# EAGLE schematic RFID_H2 (EAGLE 9.6.1)
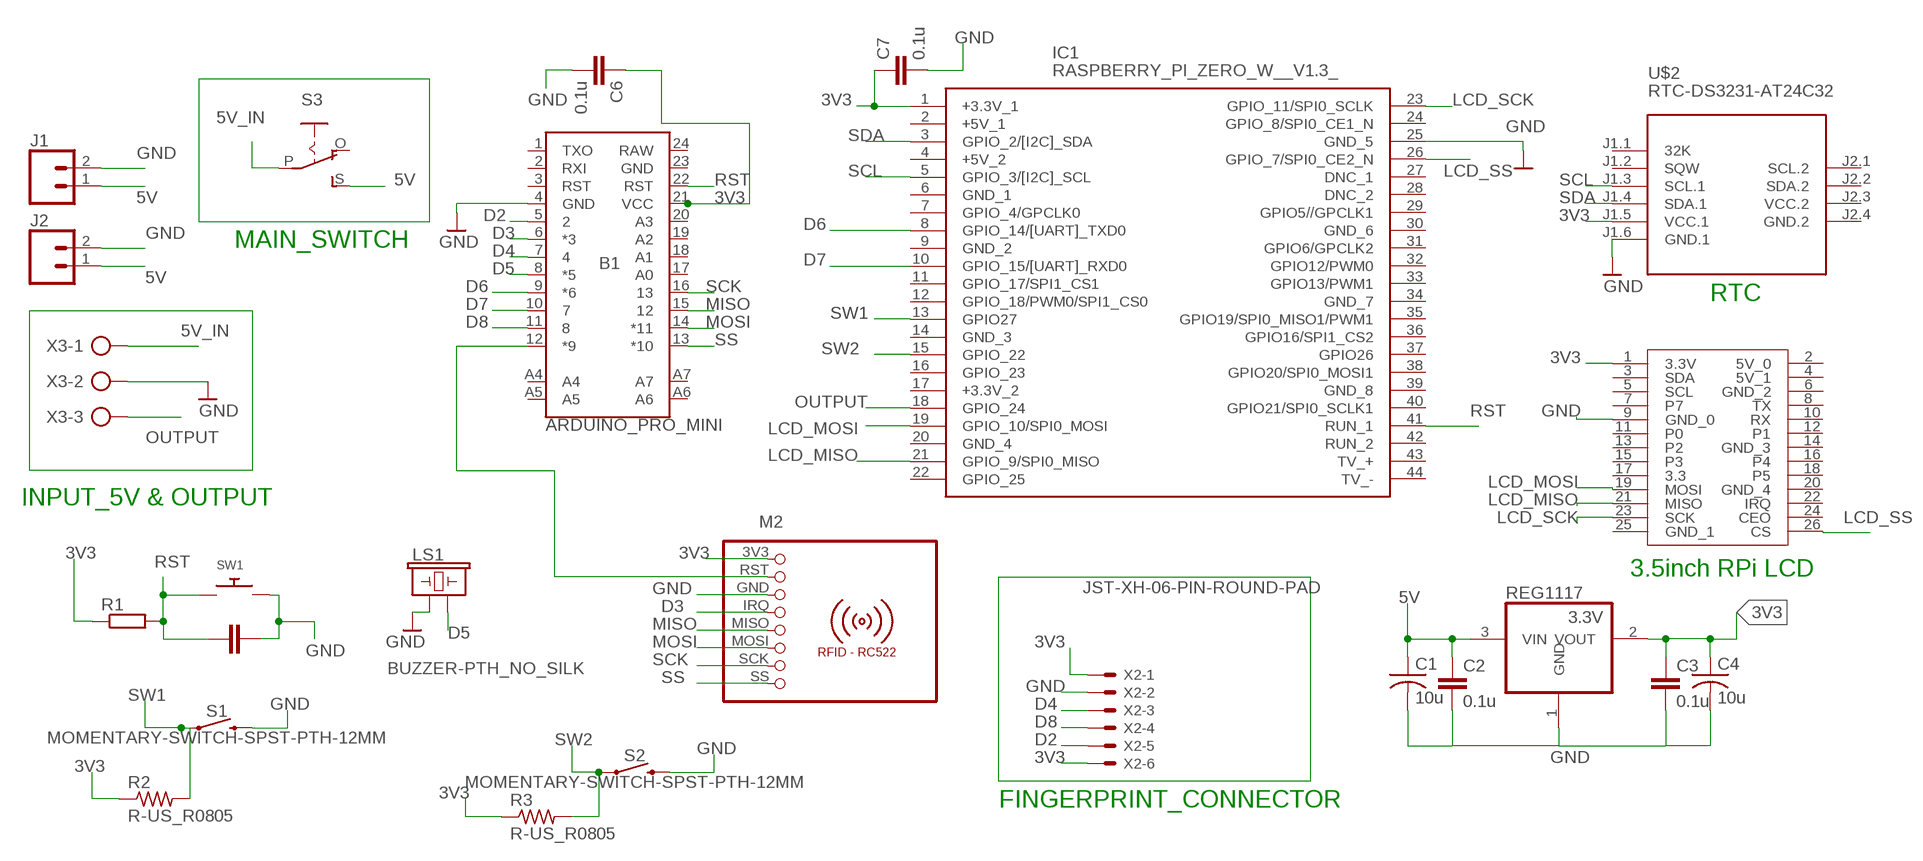
[diagram p0: schematic, sheet 1]

## Parts
B1  ARDUINO_PRO_MINI  [ARDUINO_PRO_MINI]
C1  10u  C-USC0805  [C0805]
C2  0.1u  C-EUC0805  [C0805]
C3  0.1u  C-EUC0805  [C0805]
C4  10u  C-USC0805  [C0805]
C5  10n  C-EUC0805K  [C0805K]
C6  0.1u  C-EUC0805  [C0805]
C7  0.1u  C-EUC0805  [C0805]
IC1  RASPBERRY_PI_ZERO_W__V1.3_  [RASPBERRYPIZEROWV13]
J1  CONN_02  [1X02]
J2  CONN_02  [1X02]
LS1  BUZZER-PTH_NO_SILK  [BUZZER-12MM-NS]
M2  RFID-RC522  [RFID-RC522]
R1  R-EU_0204/5  [0204/5]
R2  R-US_R0805  [R0805]
R3  R-US_R0805  [R0805]
REG1117  3.3V  REG1117  [SOT223]
S1  MOMENTARY-SWITCH-SPST-PTH-12MM  [TACTILE_SWITCH_PTH_12MM]
S2  MOMENTARY-SWITCH-SPST-PTH-12MM  [TACTILE_SWITCH_PTH_12MM]
S3  EG1218S  [EG1218]
SW1  SWITCH_PUSHBUTTONEVQ-PE  [TACT_PANA-EVQ]
U$2  RTC-DS3231-AT24C32  [RTC-DS3231-AT24C32]
U$7  3.5_INCH_TOUCHSCREEN  [FE13-2]
X2  JST-XH-06-PIN-ROUND-PAD  [JST-XH-06-PACKAGE-ROUND-PAD]
X3  AK500/3-H  [AK500/3-H]

## Nets
3V3: B1.21(VCC) C3.1 C4.1 C6.1 C7.1 IC1.1(+3.3V_1) M2.3V3 R1.1 R2.1 R3.1 REG1117.2(VOUT) U$2.J1.5(VCC.1) U$7.1(3.3V) X2.1 X2.6
5V: C1.1 C2.1 J1.1 J2.1 REG1117.3(VIN) S3.S
5V_IN: S3.P X3.1
D2: B1.5 X2.5
D3: B1.6(*3) M2.IRQ
D4: B1.7 X2.3
D5: B1.8(*5) LS1.-
D6: B1.9(*6) IC1.8(GPIO_14/[UART]_TXD0)
D7: B1.10 IC1.10(GPIO_15/[UART]_RXD0)
D8: B1.11 X2.4
GND: B1.4(GND) C1.2 C2.2 C3.2 C4.2 C5.1 C6.2 C7.2 IC1.25(GND_5) J1.2 J2.2 LS1.+ M2.GND REG1117.1(GND) S1.3 S2.3 SW1.P$2 U$2.J1.6(GND.1) U$7.9(GND_0) X2.2 X3.2
LCD_MISO: IC1.21(GPIO_9/SPI0_MISO) U$7.21(MISO)
LCD_MOSI: IC1.19(GPIO_10/SPI0_MOSI) U$7.19(MOSI)
LCD_SCK: IC1.23(GPIO_11/SPI0_SCLK) U$7.23(SCK)
LCD_SS: IC1.26(GPIO_7/SPI0_CE2_N) U$7.26(CS)
MISO: B1.15 M2.MISO
MOSI: B1.14(*11) M2.MOSI
N$1: B1.12(*9) M2.RST
OUTPUT: IC1.18(GPIO_24) X3.3
RST: B1.22(RST) C5.2 IC1.41(RUN_1) R1.2 SW1.P$1
SCK: B1.16 M2.SCK
SCL: IC1.5(GPIO_3/[I2C]_SCL) U$2.J1.3(SCL.1)
SDA: IC1.3(GPIO_2/[I2C]_SDA) U$2.J1.4(SDA.1)
SS: B1.13(*10) M2.SS
SW1: IC1.13(GPIO27) R2.2 S1.1
SW2: IC1.15(GPIO_22) R3.2 S2.1
Unconnected: B1.1(TXO) B1.2(RXI) B1.3(RST) B1.17(A0) B1.18(A1) B1.19(A2) B1.20(A3) B1.A4 B1.A5 B1.A6 B1.A7 IC1.2(+5V_1) IC1.4(+5V_2) IC1.6(GND_1) IC1.7(GPIO_4/GPCLK0) IC1.9(GND_2) IC1.11(GPIO_17/SPI1_CS1) IC1.12(GPIO_18/PWM0/SPI1_CS0) IC1.14(GND_3) IC1.16(GPIO_23) IC1.17(+3.3V_2) IC1.20(GND_4) IC1.22(GPIO_25) IC1.24(GPIO_8/SPI0_CE1_N) IC1.27(DNC_1) IC1.28(DNC_2) IC1.29(GPIO5//GPCLK1) IC1.30(GND_6) IC1.31(GPIO6/GPCLK2) IC1.32(GPIO12/PWM0) IC1.33(GPIO13/PWM1) IC1.34(GND_7) IC1.35(GPIO19/SPI0_MISO1/PWM1) IC1.36(GPIO16/SPI1_CS2) IC1.37(GPIO26) IC1.38(GPIO20/SPI0_MOSI1) IC1.39(GND_8) IC1.40(GPIO21/SPI0_SCLK1) IC1.42(RUN_2) IC1.43(TV_+) IC1.44(TV_-) S3.O U$2.J1.1(32K) U$2.J1.2(SQW) U$2.J2.1(SCL.2) U$2.J2.2(SDA.2) U$7.2(5V_0) U$7.3(SDA) U$7.4(5V_1) U$7.5(SCL) U$7.6(GND_2) U$7.7 U$7.8(TX) U$7.10(RX) U$7.11(P0) U$7.12(P1) U$7.13(P2) U$7.14(GND_3) U$7.15(P3) U$7.16(P4) U$7.17(3.3) U$7.18(P5) U$7.20(GND_4) U$7.22(IRQ) U$7.24(CEO) U$7.25(GND_1)

## Notes on the sheet
- MAIN_SWITCH
- RTC
- INPUT_5V & OUTPUT
- 3.5inch RPi LCD
- FINGERPRINT_CONNECTOR

## Power pins joined to a net without a drawn wire
GND: B1.23(GND)
GND.2: U$2.J2.4(GND.2)
RAW: B1.24(RAW)
VCC.2: U$2.J2.3(VCC.2)

## Library data of the parts
B1 = SparkFun-Boards:ARDUINO_PRO_MINI: SparkFun Pro Mini Pro Mini compatible footprint. Dimensions: 0.7 x 1.3" PCB Thickness: 0.8mm SparkFun Products: 3.3V/8MHz <https://www.sparkfun.com/products/11114> 5V/16MHz <https://www.sparkfun.com/products/11113>
C1 C4 = rcl:C-US: CAPACITOR, American symbol; SPICEPREFIX: C
C2 C3 C5-C7 = rcl:C-EU: CAPACITOR, European symbol; SPICEPREFIX: C
IC1 = Raspberry_Pi_Zero_W__v1.3_:RASPBERRY_PI_ZERO_W__V1.3_: Raspberry Pi Zero W (v1.3) Single-board Computers Source: Datasheet <https://cdn.sparkfun.com/assets/learn_tutorials/6/7/6/PiZero_1.pdf>; DESCRIPTION: Raspberry Pi Zero W (v1.3) Single-board Computers; HEIGHT: mm; MANUFACTURER_NAME: RASPBERRY-PI; MANUFACTURER_PART_NUMBER: Raspberry Pi Zero W (v1.3)
J1 J2 = SparkFun-Connectors:CONN_02: Multi connection point. Often used as Generic Header-pin footprint for 0.1 inch spaced/style header connections On any of the 0.1 inch spaced packages, you can populate with these: Break Away Headers - Straight <https://www.sparkfun.com/products/116> (PRT-00116) Break Away Male Headers - Right Angle <https://www.sparkfun.com/products/553> (PRT-00553) Female Headers <https://www.sparkfun.com/products/115> (PRT-00115) Break Away Headers - Machine Pin <https://www.sparkfun.com/products/117> (PRT-00117) Break Away Female Headers - Swiss Machine Pin <https://www.sparkfun.com/products/743> (PRT-00743) For SCREWTERMINALS and SPRING TERMINALS visit here: Screw Terimnals on SparkFun.com <https://www.sparkfun.com/search/results?term=Screw+Terminals> (5mm/3.5mm/2.54mm spacing) This device is also useful as a general connection point to wire up your design to another part of your project. Our various solder wires solder well into these plated through hole pads. Hook-Up Wire - Assortment (Stranded, 22 AWG) <https://www.sparkfun.com/products/11375> (PRT-11375) Hook-Up Wire - Assortment (Solid Core, 22 AWG) <https://www.sparkfun.com/products/11367> (PRT-11367) View the entire wire category on our website here <https://www.sparkfun.com/categories/141> Special notes: Molex polarized connector foot print use with: PRT-08233 with associated crimp pins and housings. 2.54_SCREWTERM for use with PRT-10571. 3.5mm Screw Terminal footprints for PRT-08084 5mm Screw Terminal footprints for use with PRT-08432
LS1 = SparkFun-Electromechanical:BUZZER: Buzzer Small round buzzers that operate around the audible 2kHz range. You can use these as speakers to create simple music or user interfaces. Variant Overview: PTH - Mini Speaker - PC Mount 12mm 2.048kHz <https://www.sparkfun.com/products/7950> PTH_KIT - Mini Speaker - PC Mount 12mm 2.048kHz <https://www.sparkfun.com/products/7950> KIT simplifies soldering by adding stop mask to one side of the pads. PTH_NO_SILK - Mini Speaker - PC Mount 12mm 2.048kHz <https://www.sparkfun.com/products/7950> No silkscreen indicator of buzzer outline. PTH_KIT_NO_SILK - Mini Speaker - PC Mount 12mm 2.048kHz <https://www.sparkfun.com/products/7950> KIT package w/o silkscreen SMD - Buzzer Audio Magnetic (CCV-084B16) SMD buzzer used on, e.g. the LilyPad Buzzer <https://www.sparkfun.com/products/8463> and RFID USB Reader <https://www.sparkfun.com/products/9963>. SMD_KIT - Buzzer Audio Magnetic (CCV-084B16) SMD Buzzer with elongated pins to make soldering easier. Used on the SparkFun Simon Says - Surface Mount Soldering Kit <https://www.sparkfun.com/products/10935>.; PROD_ID: COMP-08253; SF_SKU: COM-07950
M2 = mfrc522-module:RFID-RC522: RFID-RC522 MFRC-522 based breakout board
R1 = resistor:R-EU_: RESISTOR, European symbol
R2 R3 = audio amplifier example:R-US_: RESISTOR, American symbol
REG1117 = burr-brown:REG1117: 800mA and 1A Low Dropout (LDO) Positive Regulator 1.8V, 2.5V, 2.85V, 3.3V, 5V, and Adj; MPN: REG1117; OC_FARNELL: 1097566; OC_NEWARK: 14P6981
S1 S2 = SparkFun-Switches:MOMENTARY-SWITCH-SPST: Momentary Switch (Pushbutton) - SPST Normally-open (NO) SPST momentary switches (buttons, pushbuttons). Variants PTH-12MM - 12mm square, through-hole Momentary Pushbutton Switch - 12mm Square <https://www.sparkfun.com/products/9190> (COM-09190) PTH-6.0MM, PTH-6.0MM-KIT - 6.0mm square, through-hole Mini Pushbutton Switch <https://www.sparkfun.com/products/97> (COM-00097) KIT package intended for soldering kit's - only one side of pads' copper is exposed. PTH-RIGHT-ANGLE-KIT - Right-angle, through-hole Right Angle Tactile Button <https://www.sparkfun.com/products/10791> - Used on SparkFun BigTime Watch Kit <https://www.sparkfun.com/products/11734> SMD-12MM - 12mm square, surface-mount Tactile Button - SMD (12mm) <https://www.sparkfun.com/products/12993> (COM-12993) Used on SparkFun PicoBoard <https://www.sparkfun.com/products/11888> SMD-4.5MM - 4.5mm Square Trackball Switch Used on SparkFun Blackberry Trackballer Breakout <https://www.sparkfun.com/products/13169> SMD-4.6MMX2.8MM - 4.60mm x 2.80mm, surface mount Used on SparkFun SAMD21 Mini Breakout <https://www.sparkfun.com/products/13664> SMD-5.2MM, SMD-5.2-REDUNDANT - 5.2mm square, surface-mount Mini Pushbutton Switch - SMD <https://www.sparkfun.com/products/8720> (COM-08720) Used on Arduino Pro Mini <https://www.sparkfun.com/products/11114> REDUNDANT package connects both switch circuits together SMD-6.0X3.5MM - 6.0 x 3.5mm, surface mount Momentary Reset Switch SMD <https://www.sparkfun.com/products/8229> (COM-08229) SMD-6.2MM-TALL - 6.2mm square, surface mount Tactile Button - SMD (6mm) <https://www.sparkfun.com/products/12992> Used on SparkFun Digital Sandbox <https://www.sparkfun.com/products/12651> SMD-RIGHT-ANGLE - Right-angle, surface mount Used on SparkFun Block for Intel® Edison - Arduino <https://www.sparkfun.com/products/13036>; PROD_ID: SWCH-09185; SF_SKU: COM-09190
S3 = adafruit:EG1218: SLIDING SWITCH 0.1" spacing through hole, vertical SPDT slide switch http://www.ladyada.net/library/pcb/eaglelibrary.html
SW1 = adafruit:SWITCH_PUSHBUTTON: Buttons SOFTTOUCHSMD_SJ - Soft touch temporary push button (Super Junk Akihabara) Compatible with SKPMANE010 [Mouser: 688-SKPMAN] C&K_KSS = Digikey: KSS221GLFS
U$2 = diy-modules:RTC-DS3231-AT24C32: RTC Module with Battery and EEPROM based on DS3231 and AT24C32 chips Tutorial can be found here: https://edwardmallon.wordpress.com/2014/05/21/using-a-cheap-3-ds3231-rtc-at24c32-eeprom-from-ebay/ Click here to find device on ebay.com <http://www.ebay.com/sch/DS3231+AT24C32+module>
U$7 = 3.5_inch_touchscreen:3.5_INCH_TOUCHSCREEN
X2 = Rembrandt Electronics - JST XH Connectors v1-0:JST-XH-06-PIN: JST XH Connector 2 Pin Wire to board connector. Pitch: 2,54 mm, (0.100") Number of pins: 6 Created by Rembrandt Electronics www.rembrandtelectronics.com
X3 = con-ptr500:AK500/3-H: CONNECTOR Aug. 2004 / PTR Meßtechnik: Die Bezeichnung der Serie AK505 wurde geändert. Es handelt sich hierbei um AK500 in horizontaler Ausführung.; OC_FARNELL: unknown; OC_NEWARK: unknown